# EasyEDA Pro project x_terminal.eprj, schematic x_terminal
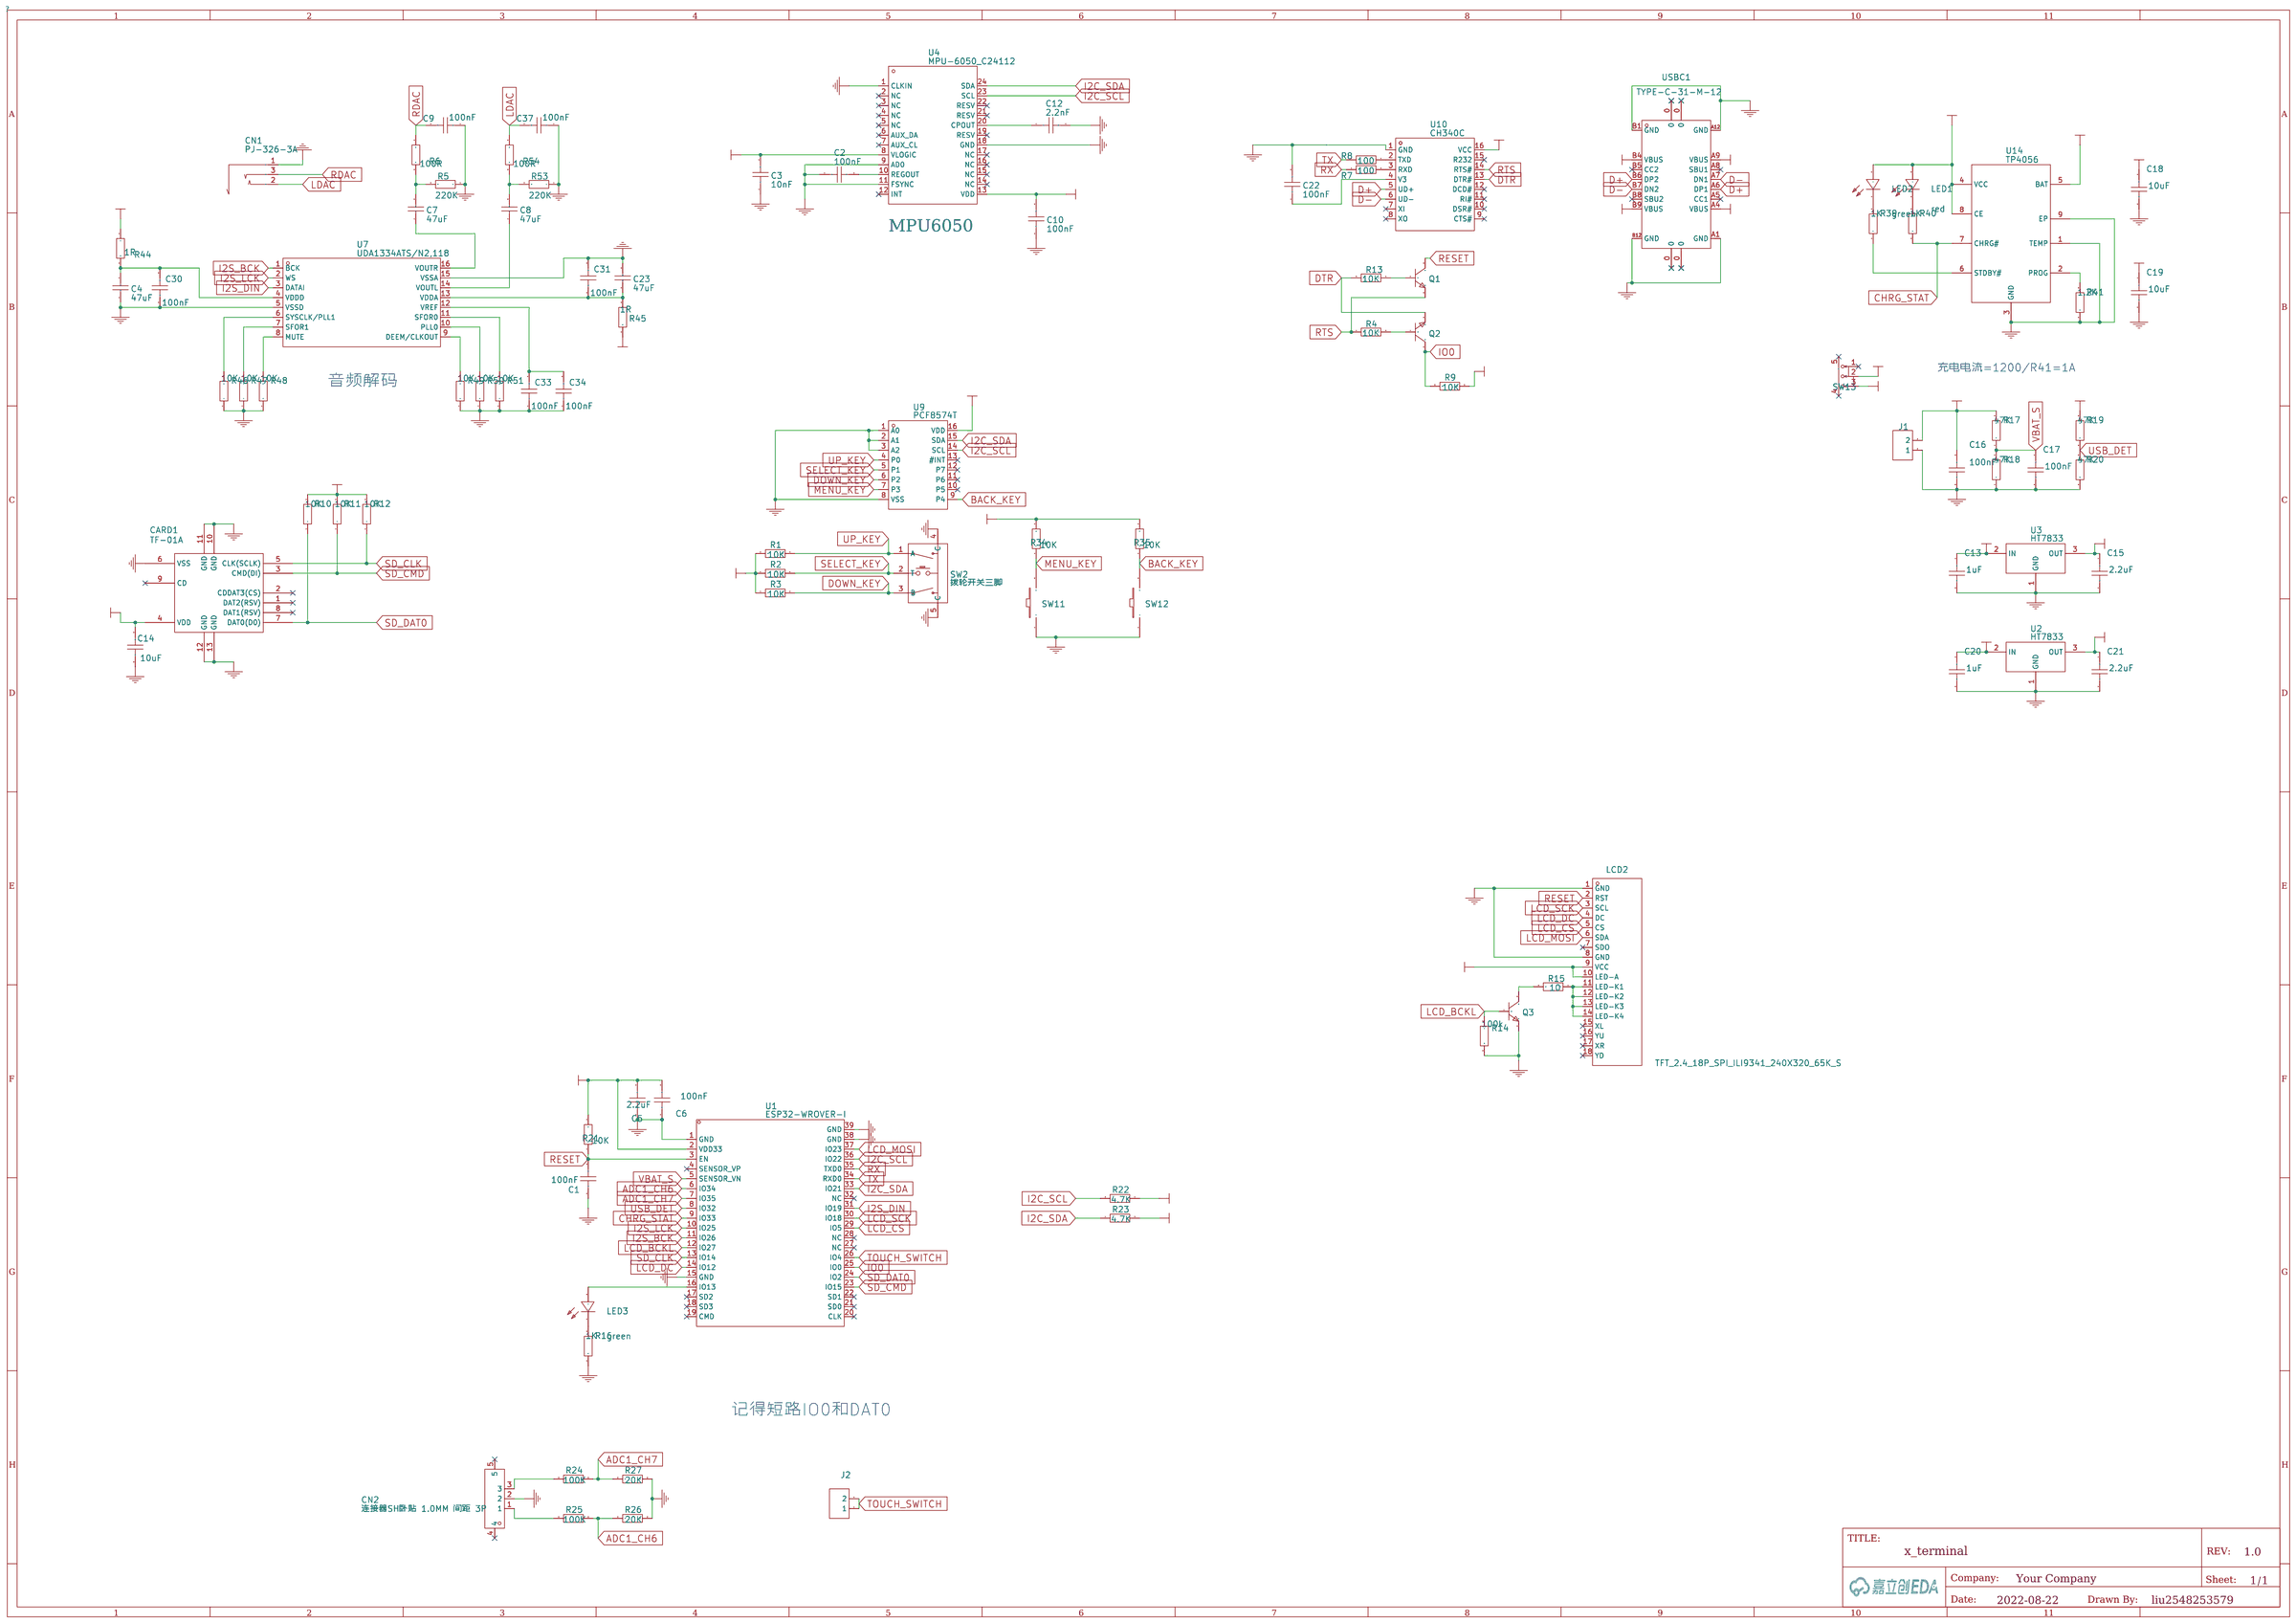
[diagram p0: schematic sheet]

## Parts
C1  100nF  [C0603]
C2  100nF  [C0603]
C3  10nF  [C0603]
C4  47uF  [C0603]
C5  2.2uF  [C0603]
C6  100nF  [C0603]
C7  47uF  [C0603]
C8  47uF  [C0603]
C9  100nF  [C0603]
C10  100nF  [C0603]
C12  2.2nF  [C0603]
C13  1uF  [C0603]
C14  10uF  [C0603]
C15  2.2uF  [C0603]
C16  100nF  [C0603]
C17  100nF  [C0603]
C18  10uF  [C0603]
C19  10uF  [C0603]
C20  1uF  [C0603]
C21  2.2uF  [C0603]
C22  100nF  [C0603]
C23  47uF  [C0603]
C30  100nF  [C0603]
C31  100nF  [C0603]
C33  100nF  [C0603]
C34  100nF  [C0603]
C37  100nF  [C0603]
CARD1  TF-01A  [TF-SMD_TF-01A]
CN1  PJ-326-3A  [AUDIO-SMD_PJ-326-3A]
CN2  连接器SH卧贴 1.0MM 间距 3P  [CONN-SMD_3P-P1.00_WAFER-SH1.0-3PWB]
J1  HDR-M-2.54_1x2  [HDR-M-2.54_1X2]
J2  HDR-M-2.54_1x2  [HDR-M-2.54_1X2]
LCD2  TFT_2.4_18P_SPI_ILI9341_240X320_65K_S  [ILI9341-2.4SPI]
LED1  red  [LED0603-RD]
LED2  green  [LED0603-RD]
LED3  green  [LED0603-RD]
Q1  S8050_C908252  [SOT-23-3_L2.9-W1.3-P1.90-LS2.4-BR]
Q2  S8050_C908252  [SOT-23-3_L2.9-W1.3-P1.90-LS2.4-BR]
Q3  S8050_C908252  [SOT-23-3_L2.9-W1.3-P1.90-LS2.4-BR]
R1  10K  [R0603]
R2  10K  [R0603]
R3  10K  [R0603]
R4  10K  [R0603]
R5  220K  [R0603]
R6  100R  [R0603]
R7  100  [R0603]
R8  100  [R0603]
R9  10K  [R0603]
R10  10K  [R0603]
R11  10K  [R0603]
R12  10K  [R0603]
R13  10K  [R0603]
R14  100k  [R0603]
R15  10  [R0603]
R16  1K  [R0603]
R17  47K  [R0603]
R18  47K  [R0603]
R19  47K  [R0603]
R20  47K  [R0603]
R21  10K  [R0603]
R22  4.7K  [R0603]
R23  4.7K  [R0603]
R24  100K  [R0603]
R25  100K  [R0603]
R26  20K  [R0603]
R27  20K  [R0603]
R34  10K  [R0603]
R35  10K  [R0603]
R39  1K  [R0603]
R40  1K  [R0603]
R41  1.2K  [R0603]
R44  1R  [R0603]
R45  1R  [R0603]
R46  10K  [R0603]
R47  10K  [R0603]
R48  10K  [R0603]
R49  10K  [R0603]
R50  10K  [R0603]
R51  10K  [R0603]
R53  220K  [R0603]
R54  100R  [R0603]
SW2  拨轮开关三脚  [拨轮开关三脚]
SW11  K2-1817UQ-C4SW-01  [KEY-SMD_2P-L6.0-W6.0-P6.00]
SW12  K2-1817UQ-C4SW-01  [KEY-SMD_2P-L6.0-W6.0-P6.00]
SW13  SK-12D07-VG3  [SW-TH_SK-12D07-VG3]
U1  ESP32-WROVER-I  [WIFIM-SMD_ESP32-WROVER-I]
U2  HT7833  [SOT-89_L4.5-W2.5-P1.50-LS4.2-BR]
U3  HT7833  [SOT-89_L4.5-W2.5-P1.50-LS4.2-BR]
U4  MPU-6050_C24112  [QFN-24_L4.0-W4.0-P0.50-BL-MPU-6050]
U7  UDA1334ATS/N2,118  [SSOP-16_L5.0-W4.4-P0.65-LS6.4-BL]
U9  PCF8574T  [SOP-16_L10.3-W7.5-P1.27-LS10.4-BL]
U10  CH340C  [SOP-16_L10.0-W3.9-P1.27-LS6.0-BL]
U14  TP4056  [SOP-8_EP_150MIL]
USBC1  TYPE-C-31-M-12  [USB-C_SMD-TYPE-C-31-M-12]

## Library data of the parts
C1 C2 C6 C9 C10 C16 C17 C22 C30 C31 C33 C34 C37 = 100nF: link: https://item.szlcsc.com/362304.html; 3DModel: C0603_L1.6-W0.8-H0.8; Supplier: LCSC; Manufacturer: YAGEO; Manufacturer Part: CC0603KRX7R9BB104; Supplier Part: C14663; JLCPCB Part Class: Basic Part
C3 = 10nF: link: https://item.szlcsc.com/362304.html; 3DModel: C0603_L1.6-W0.8-H0.8; Supplier: LCSC; Supplier Part: C389113; Manufacturer: YAGEO; Manufacturer Part: CC0603JRNPO9BN103; JLCPCB Part Class: Extended Part
C4 C7 C8 C23 = 47uF: link: https://item.szlcsc.com/362304.html; 3DModel: C0603_L1.6-W0.8-H0.8; Supplier: LCSC; Manufacturer: MuRata; Manufacturer Part: GRM188R60J476ME15D; Supplier Part: C140782; JLCPCB Part Class: Extended Part
C5 C15 C21 = 2.2uF: link: https://item.szlcsc.com/362304.html; 3DModel: C0603_L1.6-W0.8-H0.8; Supplier: LCSC; Manufacturer: YAGEO; Manufacturer Part: CC0603KRX7R9BB104; Supplier Part: C14663; JLCPCB Part Class: Basic Part
C12 = 2.2nF: link: https://item.szlcsc.com/362304.html; 3DModel: C0603_L1.6-W0.8-H0.8; Supplier: LCSC; Supplier Part: C726552; Manufacturer: YAGEO; Manufacturer Part: AC0603KRX7R0BB222; JLCPCB Part Class: Extended Part
C13 C20 = 1uF: link: https://item.szlcsc.com/362304.html; 3DModel: C0603_L1.6-W0.8-H0.8; Supplier: LCSC; Manufacturer: YAGEO; Manufacturer Part: CC0603KRX7R9BB104; Supplier Part: C14663; JLCPCB Part Class: Basic Part
C14 C18 C19 = 10uF: link: https://item.szlcsc.com/362304.html; 3DModel: C0603_L1.6-W0.8-H0.8; Supplier: LCSC; Manufacturer: YAGEO; Manufacturer Part: CC0603KRX7R9BB104; Supplier Part: C14663; JLCPCB Part Class: Basic Part
CARD1 = TF-01A: link: https://item.szlcsc.com/92334.html; 3DModel: TF-SMD_L14.8-W14.5-H1.9-P1.1; Supplier: LCSC; Manufacturer: HRO; Supplier Part: C91145; JLCPCB Part Class: Extended Part
CN1 = PJ-326-3A: link: https://atta.szlcsc.com/upload/public/pdf/source/20211207/22910966D142CC1EE8CC76ECC92F4B00.pdf; Supplier: LCSC; Supplier Part: C2910522; Manufacturer: 韩国韩荣; JLCPCB Part Class: Extended Part
CN2 = 连接器SH卧贴 1.0MM 间距 3P: link: https://img.jlc.com/image//data/smt-stock-produce/componentSizePhoto/2022-06-19/4891adfe43314fc1a76dd80e608feb8d/BG2206180901_D22061702799_back.png; Supplier: LCSC; Supplier Part: C9900022975; Manufacturer: null; Manufacturer Part: 连接器SH卧贴 1.0mm 间距 3P
J1 J2 = HDR-M-2.54_1x2: Supplier Part: C124375; Supplier: LCSC
LCD2 = TFT_2.4_18P_SPI_ILI9341_240X320_65K_S
LED1 = red: link: https://item.szlcsc.com/347874.html; Supplier: LCSC; Supplier Part: C118334; Manufacturer: Wuxi ARK Tech Elec; Manufacturer Part: D-G060306G1-KS2; JLCPCB Part Class: Extended Part
LED2 LED3 = green: link: https://item.szlcsc.com/347874.html; Supplier: LCSC; Supplier Part: C118334; Manufacturer: Wuxi ARK Tech Elec; Manufacturer Part: D-G060306G1-KS2; JLCPCB Part Class: Extended Part
Q1-Q3 = S8050_C908252: link: https://www.diodes.com/assets/Package-Files/SOT23.pdf; 3DModel: SOT-23-3P_L2.9-W1.3-H1.0-LS2.4-P0.95; Supplier: LCSC; Supplier Part: C908252; Manufacturer: FUXINSEMI; Manufacturer Part: S8050; JLCPCB Part Class: Extended Part
R1-R4 R9-R13 R21 R34 R35 R46-R51 = 10K: 3DModel: R0603_L1.6-W0.8-H0.8; link: https://www.mouser.in/datasheet/2/447/PYu_RT_1_to_0_01_RoHS_L_11-1669912.pdf; Supplier: LCSC; Manufacturer: UniOhm; Manufacturer Part: 0603WAF1002T5E; Supplier Part: C25804; JLCPCB Part Class: Basic Part
R5 R53 = 220K: 3DModel: R0603_L1.6-W0.8-H0.8; link: https://www.mouser.in/datasheet/2/447/PYu_RT_1_to_0_01_RoHS_L_11-1669912.pdf; Supplier: LCSC; Manufacturer: UniOhm; Manufacturer Part: 0603WAF1002T5E; Supplier Part: C25804; JLCPCB Part Class: Basic Part
R6 R54 = 100R: 3DModel: R0603_L1.6-W0.8-H0.8; link: https://www.mouser.in/datasheet/2/447/PYu_RT_1_to_0_01_RoHS_L_11-1669912.pdf; Supplier: LCSC; Manufacturer: UniOhm; Manufacturer Part: 0603WAF1002T5E; Supplier Part: C25804; JLCPCB Part Class: Basic Part
R7 R8 = 100: 3DModel: R0603_L1.6-W0.8-H0.8; link: https://www.mouser.in/datasheet/2/447/PYu_RT_1_to_0_01_RoHS_L_11-1669912.pdf; Supplier: LCSC; Manufacturer: UniOhm; Manufacturer Part: 0603WAF1002T5E; Supplier Part: C25804; JLCPCB Part Class: Basic Part
R14 = 100k: 3DModel: R0603_L1.6-W0.8-H0.8; link: https://www.mouser.in/datasheet/2/447/PYu_RT_1_to_0_01_RoHS_L_11-1669912.pdf; Supplier: LCSC; Manufacturer: UniOhm; Manufacturer Part: 0603WAF1002T5E; Supplier Part: C25804; JLCPCB Part Class: Basic Part
R15 = 10: 3DModel: R0603_L1.6-W0.8-H0.8; link: https://www.mouser.in/datasheet/2/447/PYu_RT_1_to_0_01_RoHS_L_11-1669912.pdf; Supplier: LCSC; Manufacturer: UniOhm; Manufacturer Part: 0603WAF1002T5E; Supplier Part: C25804; JLCPCB Part Class: Basic Part
R16 R39 R40 = 1K: 3DModel: R0603_L1.6-W0.8-H0.8; link: https://www.mouser.in/datasheet/2/447/PYu_RT_1_to_0_01_RoHS_L_11-1669912.pdf; Supplier: LCSC; Manufacturer: UniOhm; Manufacturer Part: 0603WAF1002T5E; Supplier Part: C25804; JLCPCB Part Class: Basic Part
R17-R20 = 47K: 3DModel: R0603_L1.6-W0.8-H0.8; link: https://www.mouser.in/datasheet/2/447/PYu_RT_1_to_0_01_RoHS_L_11-1669912.pdf; Supplier: LCSC; Manufacturer: UniOhm; Manufacturer Part: 0603WAF1002T5E; Supplier Part: C25804; JLCPCB Part Class: Basic Part
R22 R23 = 4.7K: 3DModel: R0603_L1.6-W0.8-H0.8; link: https://www.mouser.in/datasheet/2/447/PYu_RT_1_to_0_01_RoHS_L_11-1669912.pdf; Supplier: LCSC; Manufacturer: UniOhm; Manufacturer Part: 0603WAF1002T5E; Supplier Part: C25804; JLCPCB Part Class: Basic Part
R24 R25 = 100K: 3DModel: R0603_L1.6-W0.8-H0.8; link: https://www.mouser.in/datasheet/2/447/PYu_RT_1_to_0_01_RoHS_L_11-1669912.pdf; Supplier: LCSC; Manufacturer: UniOhm; Manufacturer Part: 0603WAF1002T5E; Supplier Part: C25804; JLCPCB Part Class: Basic Part
R26 R27 = 20K: 3DModel: R0603_L1.6-W0.8-H0.8; link: https://www.mouser.in/datasheet/2/447/PYu_RT_1_to_0_01_RoHS_L_11-1669912.pdf; Supplier: LCSC; Manufacturer: UniOhm; Manufacturer Part: 0603WAF1002T5E; Supplier Part: C25804; JLCPCB Part Class: Basic Part
R41 = 1.2K: 3DModel: R0603_L1.6-W0.8-H0.8; link: https://www.mouser.in/datasheet/2/447/PYu_RT_1_to_0_01_RoHS_L_11-1669912.pdf; Supplier: LCSC; Manufacturer: UniOhm; Manufacturer Part: 0603WAF1002T5E; Supplier Part: C25804; JLCPCB Part Class: Basic Part
R44 R45 = 1R: 3DModel: R0603_L1.6-W0.8-H0.8; link: https://www.mouser.in/datasheet/2/447/PYu_RT_1_to_0_01_RoHS_L_11-1669912.pdf; Supplier: LCSC; Manufacturer: UniOhm; Manufacturer Part: 0603WAF1002T5E; Supplier Part: C25804; JLCPCB Part Class: Basic Part
SW2 = 拨轮开关三脚
SW11 SW12 = K2-1817UQ-C4SW-01: link: https://lcsc.com/product-detail/Tactile-Switches_Made-in-China-Made-in-China-6-6-5-Silicone-Silently-Touch-the-button_C61120.html; 3DModel: KEY-SMD_2P-L6.0-W6.0-H5.0-P6.00; Supplier: LCSC; Manufacturer: HRO; Supplier Part: C128939; JLCPCB Part Class: Extended Part
SW13 = SK-12D07-VG3: link: https://item.szlcsc.com/538612.html; Supplier: LCSC; Supplier Part: C521448; Manufacturer: USAKRO(美韩); JLCPCB Part Class: Extended Part
U1 = ESP32-WROVER-I: link: https://item.szlcsc.com/143669.html; 3DModel: WIFIM-SMD_L31.4-W18.0-H3.5-ESP32-WROVER-I; Supplier: LCSC; Supplier Part: C132370; Manufacturer: Espressif Systems; JLCPCB Part Class: Extended Part
U2 U3 = HT7833: link: https://item.szlcsc.com/236145.html; 3DModel: SOT-89-3_L4.3-W2.5-H1.6-LS4.1-P1.50; Supplier: LCSC; Manufacturer: HOLTEK; Supplier Part: C50936; JLCPCB Part Class: Extended Part
U4 = MPU-6050_C24112: link: https://cn.bing.com/search?q=datasheet: MPU-6050; 3DModel: QFN-24_L4.0-W4.0-H0.9-P0.50-; Supplier: LCSC; Manufacturer: InvenSense; Manufacturer Part: MPU-6050; Supplier Part: C24112; JLCPCB Part Class: Basic Part
U7 = UDA1334ATS/N2,118: link: https://item.szlcsc.com/106458.html; Supplier: LCSC; Supplier Part: C494494; Manufacturer: NXP Semicon; JLCPCB Part Class: Extended Part
U9 = PCF8574T: link: https://www.ti.com.cn/cn/lit/ds/symlink/iso6742.pdf?ts=1616297563934; 3DModel: SOP-16_L10.3-W7.5-H2.1-LS10.0-P1.27; Supplier: LCSC; Supplier Part: C398075; Manufacturer: HGSEMI
U10 = CH340C: link: https://item.szlcsc.com/391677.html; Supplier Part: C84681; Supplier: LCSC; Manufacturer: WCH; 3DModel: SOP-16_L9.9-W3.9-H1.5-LS6.0-P1.27; JLCPCB Part Class: Extend
U14 = TP4056: Supplier: LCSC; Manufacturer: TOPPOWER; image: //image.lceda.cn/szlcsc/C16581.jpg; Supplier Part: C16581; JLCPCB Part Class: Basic
USBC1 = TYPE-C-31-M-12: link: https://so.szlcsc.com/global.html?c=&k=C165948; Supplier: LCSC; Supplier Part: C165948; Manufacturer: Rectangular Connectors - Contacts; JLCPCB Part Class: Extended Part

## Nets
3V3: C3.2 C5.2 C6.2 C10.2 C14.1 C21.1 CARD1.4(VDD) R1.2 R2.1 R3.1 R9.1 R10.2 R11.2 R12.2 R21.2 R22.1 R23.2 R34.2 R35.2 R44.1 R45.1 U1.2(VDD33) U2.3(OUT) U4.8(VLOGIC) U4.13(VDD) U9.16(VDD)
3V3_LCD: C15.1 LCD2.9(VCC) LCD2.10(LED-A) U3.3(OUT)
GND: C1.1 C2.1 C3.1 C4.1 C5.1 C6.1 C9.1 C10.1 C12.2 C13.2 C14.2 C15.2 C16.2 C17.2 C18.2 C19.2 C20.2 C21.2 C22.2 C23.2 C30.1 C31.2 C33.1 C34.1 C37.1 CARD1.6(VSS) CARD1.10(GND) CARD1.11(GND) CARD1.12(GND) CARD1.13(GND) CN1.1 CN2.2 J1.1 LCD2.1(GND) LCD2.8(GND) Q3.2(E) R5.1 R14.2 R16.1 R18.1 R20.1 R26.2 R27.2 R41.1 R46.1 R47.1 R48.1 R49.1 R50.1 R51.1 R53.1 SW2.4(C) SW2.5(C) SW11.1 SW12.1 U1.1(GND) U1.15(GND) U1.38(GND) U1.39(GND) U2.1(GND) U3.1(GND) U4.1(CLKIN) U4.9(AD0) U4.11(FSYNC) U4.18(GND) U7.5(VSSD) U7.15(VSSA) U9.1(A0) U9.2(A1) U9.3(A2) U9.8(VSS) U10.1(GND) U14.1(TEMP) U14.3(GND) U14.9(EP) USBC1.A1(GND) USBC1.A12(GND) USBC1.B1(GND) USBC1.B12(GND)
VBAT_S: C17.1 R17.1 R18.2 U1.5(SENSOR_VN)
VIN: C13.1 C20.1 SW13.2 U2.2(IN) U3.2(IN)
ADC1_CH6: R25.2 R26.1 U1.6(IO34)
ADC1_CH7: R24.2 R27.1 U1.7(IO35)
BACK_KEY: R35.1 SW12.2 U9.9(P4)
CHRG_STAT: R40.1 U1.9(IO33) U14.7(CHRG#)
D+: U10.5(UD+) USBC1.A6(DP1) USBC1.B6(DP2)
D-: U10.6(UD-) USBC1.A7(DN1) USBC1.B7(DN2)
DOWN_KEY: R3.2 SW2.3(B) U9.6(P2)
DTR: Q2.2(E) R13.2 U10.13(DTR#)
I2C_SCL: R22.2 U1.36(IO22) U4.23(SCL) U9.14(SCL)
I2C_SDA: R23.1 U1.33(IO21) U4.24(SDA) U9.15(SDA)
I2S_BCK: U1.11(IO26) U7.1(BCK)
I2S_DIN: U1.31(IO19) U7.3(DATAI)
I2S_LCK: U1.10(IO25) U7.2(WS)
IO0: Q2.3(C) R9.2 U1.25(IO0)
LCD_BCKL: Q3.1(B) R14.1 U1.12(IO27)
LCD_CS: LCD2.5(CS) U1.29(IO5)
LCD_DC: LCD2.4(DC) U1.14(IO12)
LCD_MOSI: LCD2.6(SDA) U1.37(IO23)
LCD_SCK: LCD2.3(SCL) U1.30(IO18)
LDAC: C37.2 CN1.2 R54.1
MENU_KEY: R34.1 SW11.2 U9.7(P3)
RDAC: C9.2 CN1.3 R6.1
RESET: C1.2 LCD2.2(RST) Q1.3(C) R21.1 U1.3(EN)
RTS: Q1.2(E) R4.1 U10.14(RTS#)
RX: R7.1 U1.35(TXD0)
SD_CLK: CARD1.5(CLK(SCLK)) R12.1 U1.13(IO14)
SD_CMD: CARD1.3(CMD(DI)) R11.1 U1.23(IO15)
SD_DAT0: CARD1.7(DAT0(D0)) R10.1 U1.24(IO2)
SELECT_KEY: R2.2 SW2.2(T) U9.5(P1)
TOUCH_SWITCH: J2.1 J2.2 U1.26(IO4)
TX: R8.1 U1.34(RXD0)
UP_KEY: R1.1 SW2.1(A) U9.4(P0)
USB_DET: R19.1 R20.2 U1.8(IO32)
V_BATT: C16.1 C19.1 J1.2 R17.2 SW13.3 U14.5(BAT)
V_USB: C18.1 LED1.2(+) LED2.2(+) R19.2 U10.16(VCC) U14.4(VCC) U14.8(CE) USBC1.A4(VBUS) USBC1.A9(VBUS) USBC1.B4(VBUS) USBC1.B9(VBUS)
Net-(C2-2): C2.2 U4.10(REGOUT)
Net-(C4-2): C4.2 C30.2 R44.2 U7.4(VDDD)
Net-(C7-1): C7.1 U7.16(VOUTR)
Net-(C7-2): C7.2 R5.2 R6.2
Net-(C8-1): C8.1 U7.14(VOUTL)
Net-(C8-2): C8.2 R53.2 R54.2
Net-(C12-1): C12.1 U4.20(CPOUT)
Net-(C22-1): C22.1 U10.4(V3)
Net-(C23-1): C23.1 C31.1 R45.2 U7.13(VDDA)
Net-(C33-2): C33.2 C34.2 U7.12(VREF)
Net-(CN2-1): CN2.1 R25.1
Net-(CN2-3): CN2.3 R24.1
Net-(LCD2-11): LCD2.11(LED-K1) LCD2.12(LED-K2) LCD2.13(LED-K3) LCD2.14(LED-K4) R15.1
Net-(LED1-1): LED1.1(-) R40.2
Net-(LED2-1): LED2.1(-) R39.2
Net-(LED3-1): LED3.1(-) R16.2
Net-(LED3-2): LED3.2(+) U1.16(IO13)
Net-(Q1-1): Q1.1(B) R13.1
Net-(Q2-1): Q2.1(B) R4.2
Net-(Q3-3): Q3.3(C) R15.2
Net-(R7-2): R7.2 U10.3(RXD)
Net-(R8-2): R8.2 U10.2(TXD)
Net-(R39-1): R39.1 U14.6(STDBY#)
Net-(R41-2): R41.2 U14.2(PROG)
Net-(R46-2): R46.2 U7.6(SYSCLK/PLL1)
Net-(R47-2): R47.2 U7.7(SFOR1)
Net-(R48-2): R48.2 U7.8(MUTE)
Net-(R49-2): R49.2 U7.9(DEEM/CLKOUT)
Net-(R50-2): R50.2 U7.10(PLL0)
Net-(R51-2): R51.2 U7.11(SFOR0)

Not connected (* = marked no-connect by the designer): CARD1 1(DAT2(RSV))* 2(CDDAT3(CS))* 8(DAT1(RSV))* 9(CD)*; CN2 4* 5*; LCD2 7(SDO)* 15(XL)* 16(YU)* 17(XR)* 18(YD)*; SW13 1* 4* 5*; U1 4(SENSOR_VP)* 17(SD2)* 18(SD3)* 19(CMD)* 20(CLK)* 21(SD0)* 22(SD1)* 27(NC)* 28(NC)* 32(NC)*; U4 2(NC)* 3(NC)* 4(NC)* 5(NC)* 6(AUX_DA)* 7(AUX_CL)* 12(INT)* 14(NC)* 15(NC)* 16(NC)* 17(NC)* 19(RESV)* 21(RESV)* 22(RESV)*; U9 10(P5)* 11(P6)* 12(P7)* 13(#INT)*; U10 7(XI)* 8(XO)* 9(CTS#)* 10(DSR#)* 11(RI#)* 12(DCD#)* 15(R232)*; USBC1 0* A5(CC1)* A8(SBU1)* B5(CC2)* B8(SBU2)*

## Notes on the sheet
- MPU6050
- 充电电流=1200/R41=1A
- 音频解码
- 记得短路IO0和DAT0
